# Altium schematic sheet connector_temp.SchDoc
size A
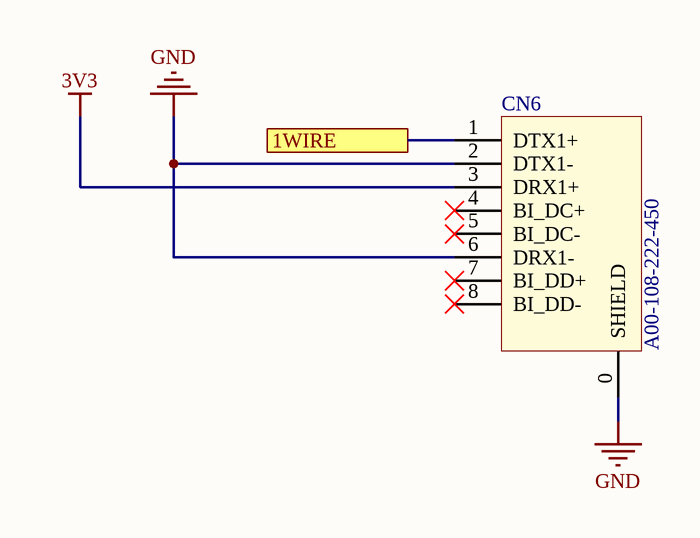
[diagram p0: connector_temp.SchDoc]

## Parts
CN6  MFG P/N: A00-108-222-450  [RJ45 TOP ENTRY EDAC A00-108-222-450]  (hidden comment: CONN_RJ45_TOP_A00-108-222-450)

## Ports
1WIRE

## Nets
3V3: CN6.3(DRX1+)
GND: CN6.0(SHIELD) CN6.2(DTX1-) CN6.6(DRX1-)
1WIRE: CN6.1(DTX1+) ; port 1WIRE

Not connected (* = marked no-connect by the designer): CN6 4(BI_DC+)* 5(BI_DC-)* 7(BI_DD+)* 8(BI_DD-)*

## Library data of the parts
CN6 = 492: CONN, RJ-45, 1-PORT, 8-POS, VERT, 0.76um GOLD, TH; ID: 492; MFG: EDAC Inc; COMMON: 210-00203-00; XPN: XS-10003929; Status: In Development; RoHS Compliant: Yes; LOON: 210-00203-00; Gecko: 210-00203-00